# EAGLE design 99 (EAGLE 9.6.1)
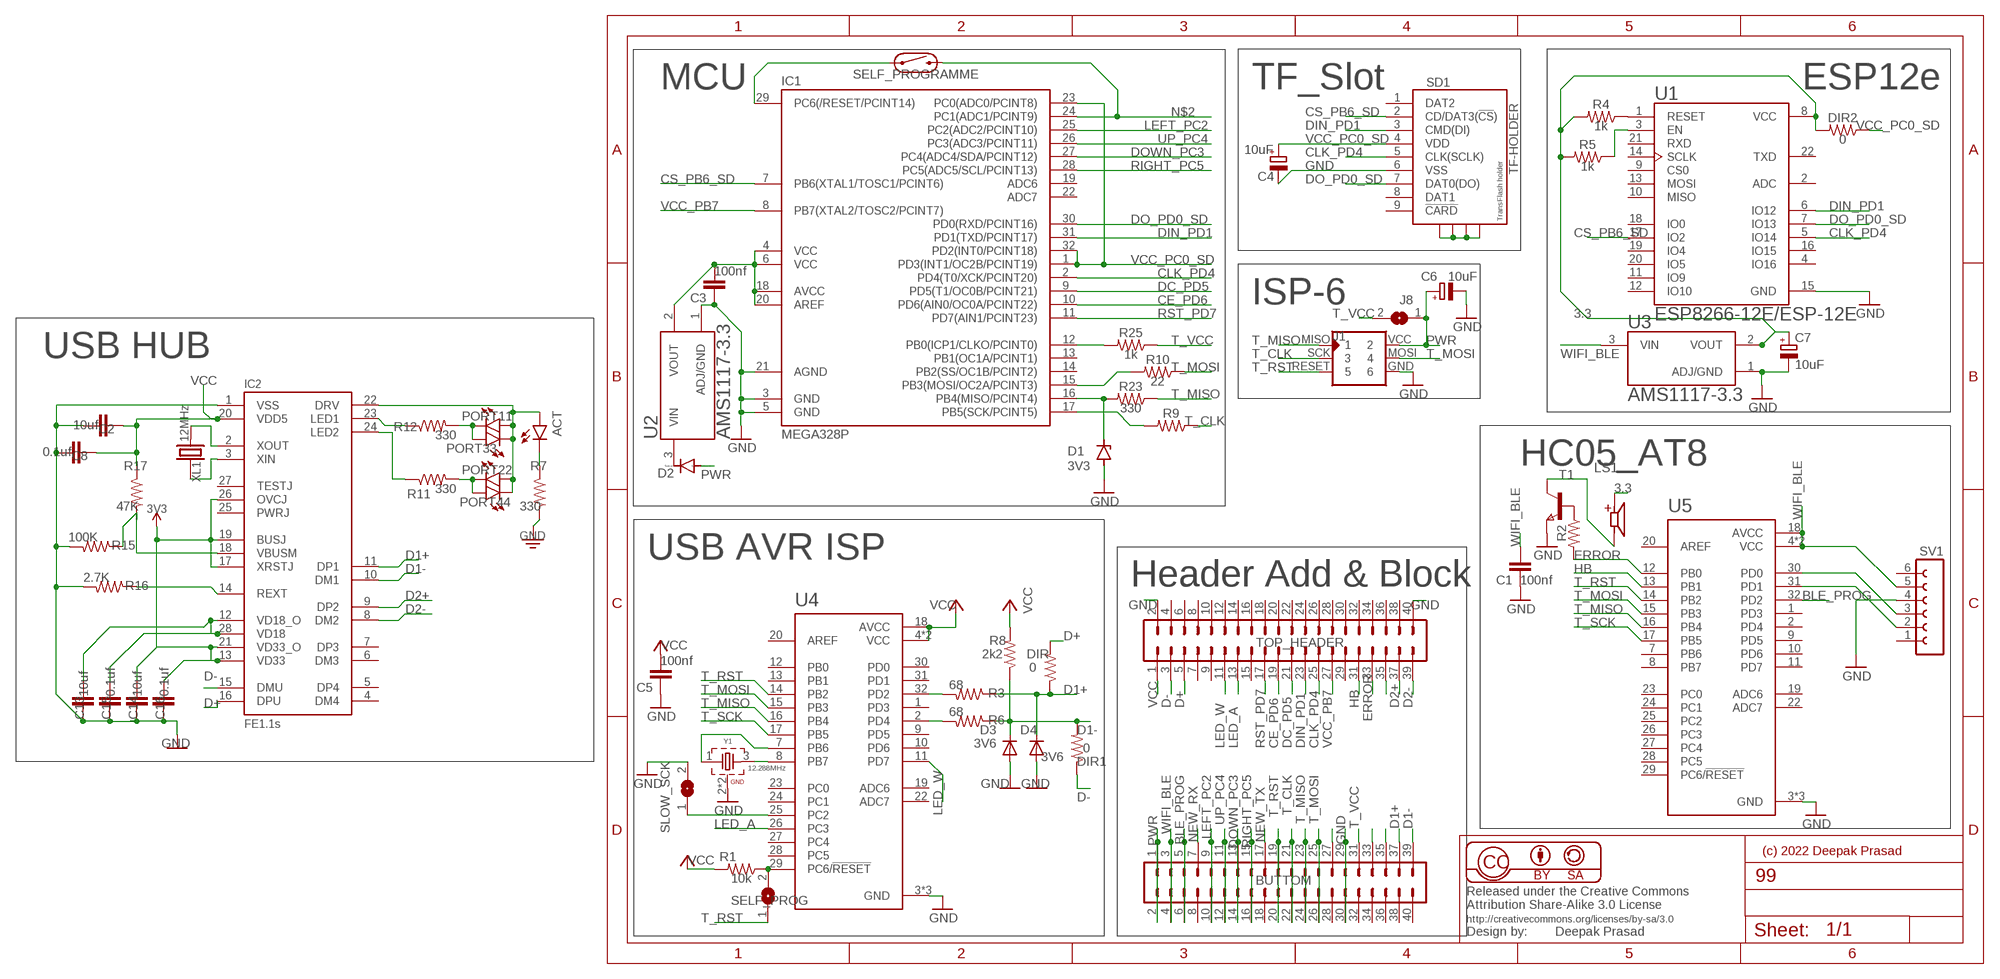
[diagram p0: schematic, sheet 1]

## Parts
ACT  LED1206  [LED-1206]
BUTTOM  MA20-2  [MA20-2]
C1  100nf  C-EUC1206  [C1206]
C2  10uf  C-EUC1206  [C1206]
C3  100nf  C-EUC1206  [C1206]
C4  10uF  CPOL-EUC/6032-28R  [C/6032-28R]
C5  100nf  C-EUC1206  [C1206]
C6  10uF  CPOL-EUC/6032-28R  [C/6032-28R]
C7  10uF  CPOL-EUC/6032-28R  [C/6032-28R]
C8  0.1uf  C-EUC1206  [C1206]
C13  10uf  C-EUC1206  [C1206]
C14  10uf  C-EUC1206  [C1206]
C15  0.1uf  C-EUC1206  [C1206]
C16  0.1uf  C-EUC1206  [C1206]
D1  3V3  ZENER-DIODESOD80C  [SOD80C]
D2  DIODE-DO214AC  [DO214AC]
D3  3V6  DIODESMA  [SMA-DIODE]
D4  3V6  DIODESMA  [SMA-DIODE]
DIR  0  R-US_CHIP-1206(3216-METRIC)  [RESC3216X70]
DIR1  0  R-US_CHIP-1206(3216-METRIC)  [RESC3216X70]
DIR2  0  R-US_CHIP-1206(3216-METRIC)  [RESC3216X70]
IC1  MEGA328P  MEGA48/88/168-AU  [TQFP32-08]
IC2  FE1.1S  [FE1.1S_SSOP-28]
J1  AVR-ISP-6PINAVR-ISP-6PIN  [AVR-ISP-6PIN]
J8  SJW  [SJW]
LS1  CMT-8530S-SMT  [CUI_CMT-8530S-SMT]
PORT11  LED1206  [LED-1206]
PORT22  LED1206  [LED-1206]
PORT33  LED1206  [LED-1206]
PORT44  LED1206  [LED-1206]
R1  10k  R-US_CHIP-1206(3216-METRIC)  [RESC3216X70]
R2  22  R-US_CHIP-1206(3216-METRIC)  [RESC3216X70]
R3  68  R-US_CHIP-1206(3216-METRIC)  [RESC3216X70]
R4  1k  R-US_CHIP-1206(3216-METRIC)  [RESC3216X70]
R5  1k  R-US_CHIP-1206(3216-METRIC)  [RESC3216X70]
R6  68  R-US_CHIP-1206(3216-METRIC)  [RESC3216X70]
R7  330  R-US_CHIP-1206(3216-METRIC)  [RESC3216X70]
R8  2k2  R-US_CHIP-1206(3216-METRIC)  [RESC3216X70]
R9  22  R-US_CHIP-1206(3216-METRIC)  [RESC3216X70]
R10  22  R-US_CHIP-1206(3216-METRIC)  [RESC3216X70]
R11  330  R-US_CHIP-1206(3216-METRIC)  [RESC3216X70]
R12  330  R-US_CHIP-1206(3216-METRIC)  [RESC3216X70]
R15  100K  R-US_CHIP-1206(3216-METRIC)  [RESC3216X70]
R16  2.7K  R-US_CHIP-1206(3216-METRIC)  [RESC3216X70]
R17  47K  R-US_CHIP-1206(3216-METRIC)  [RESC3216X70]
R23  330  R-US_CHIP-1206(3216-METRIC)  [RESC3216X70]
R25  1k  R-US_CHIP-1206(3216-METRIC)  [RESC3216X70]
SD1  TF-HOLDER  [TF-PULL]
SELF_PROG  SJW  [SJW]
SELF_PROGRAMME  REED_SWITCH-PTH-GLASS  [REED_SWITCH_GLASS]
SLOW_SCK  SJW  [SJW]
SV1  FE06-1  [FE06]
T1  NPNSOT23  [SOT-23]
TOP_HEADER  MA20-2  [MA20-2]
U1  ESP8266-12E/ESP-12E  [XCVR_ESP8266-12E/ESP-12E]
U2  AMS1117-3.3  [SOT229P700X180-4N]
U3  AMS1117-3.3  [SOT229P700X180-4N]
U4  ATMEGA328P-AU  [QFP80P900X900X120-32N]
U5  ATMEGA328P-AU  [QFP80P900X900X120-32N]
XL1  12MHz  CRYSTALHC49UP  [HC49UP]
Y1  12.288MHz  WE-XTAL_CFPX-104_830059523  [WE-XTAL_CFPX-104]

## Nets
3.3: C7.+ DIR2.2 LS1.P R4.2 R5.2 U1.8(VCC) U3.2(VOUT)
3V3: C14.2 C16.2 IC2.13(VD33) IC2.17(XRSTJ) IC2.19(BUSJ) IC2.21(VD33_O) IC2.26(OVCJ)
BLE_PROG: BUTTOM.5 BUTTOM.6 U5.32(PD2)
CE_PD6: IC1.10(PD6(AIN0/OC0A/PCINT22)) TOP_HEADER.19
CLK_PD4: IC1.2(PD4(T0/XCK/PCINT20)) SD1.5(CLK(SCLK)) TOP_HEADER.25 U1.5(IO14)
CS_PB6_SD: IC1.7(PB6(XTAL1/TOSC1/PCINT6)) SD1.2(CD/DAT3(!CS!)) U1.17(IO2)
D1+: BUTTOM.37 D4.C DIR.1 IC2.11(DP1) R3.1
D1-: BUTTOM.39 D3.C DIR1.2 IC2.10(DM1) R6.1 R8.1
D2+: IC2.9(DP2) TOP_HEADER.37
D2-: IC2.8(DM2) TOP_HEADER.39
D+: DIR.2 IC2.16(DPU) TOP_HEADER.5
D-: DIR1.1 IC2.15(DMU) TOP_HEADER.3
DC_PD5: IC1.9(PD5(T1/OC0B/PCINT21)) TOP_HEADER.21
DIN_PD1: IC1.31(PD1(TXD/PCINT17)) SD1.3(CMD(DI)) TOP_HEADER.23 U1.6(IO12)
DO_PD0_SD: IC1.30(PD0(RXD/PCINT16)) SD1.7(DAT0(DO)) U1.7(IO13)
DOWN_PC3: BUTTOM.13 BUTTOM.14 IC1.27(PC4(ADC4/SDA/PCINT12))
ERROR: R2.2 TOP_HEADER.33 U5.12(PB0)
GND [POWER]: BUTTOM.29 BUTTOM.30 C1.1 C2.2 C3.1 C4.- C5.1 C6.- C7.- C8.2 C13.1 C14.1 C15.1 C16.1 D1.A D3.A D4.A IC1.3(GND) IC1.5(GND) IC1.21(AGND) IC2.1(VSS) J1.GND R7.2 R15.2 R16.2 SD1.6(VSS) SLOW_SCK.2 SV1.4 T1.2(E) TOP_HEADER.2 TOP_HEADER.40 U1.15(GND) U2.1(ADJ/GND) U3.1(ADJ/GND) U4.3(GND) U4.5(GND) U4.21(GND) U5.3(GND) U5.5(GND) U5.21(GND) Y1.2(GND) Y1.4(GND)
GND1: SD1.S1 SD1.S2 SD1.S3 SD1.S4
HB: TOP_HEADER.31 U5.13(PB1)
LED_A: TOP_HEADER.13 U4.26(PC3)
LED_W: TOP_HEADER.11 U4.11(PD7)
LEFT_PC2: BUTTOM.9 BUTTOM.10 IC1.25(PC2(ADC2/PCINT10))
N$1: U4.8(PB7) Y1.3
N$2: IC1.24(PC1(ADC1/PCINT9)) SELF_PROGRAMME.P$2
N$3: R4.1 U1.1(RESET)
N$4: R2.1 T1.3(B)
N$5: R5.1 U1.3(EN)
N$6: IC1.12(PB0(ICP1/CLKO/PCINT0)) R25.2
N$7: D1.C IC1.16(PB4(MISO/PCINT4)) R23.2
N$8: U4.7(PB6) Y1.1
N$9: C3.2 IC1.4(VCC) IC1.6(VCC) IC1.18(AVCC) IC1.20(AREF) U2.2(VOUT)
N$10: R1.1 SELF_PROG.2 U4.29(PC6/!RESET)
N$11: D2.C U2.3(VIN)
N$12: IC1.29(PC6(/RESET/PCINT14)) SELF_PROGRAMME.P$1
N$13: SLOW_SCK.1 U4.25(PC2)
N$14: SV1.2 U5.31(PD1)
N$15: SV1.3 U5.30(PD0)
N$16: R3.2 U4.32(PD2)
N$17: IC2.14(REXT) R16.1
N$18: ACT.C R7.1
N$19: R6.2 U4.2(PD4)
N$20: C13.2 C15.2 IC2.12(VD18_O) IC2.28(VD18)
N$21: IC1.15(PB3(MOSI/OC2A/PCINT3)) R10.2
N$22: IC1.17(PB5(SCK/PCINT5)) R9.2
N$23: LS1.N T1.1(C)
N$24: IC2.23(LED1) R12.1
N$25: IC2.2(XOUT) XL1.2
N$26: IC2.3(XIN) XL1.1
N$27: PORT11.C PORT33.A R12.2
N$28: PORT22.C PORT44.A R11.2
N$32: TOP_HEADER.35
N$38: IC2.18(VBUSM) R15.1 R17.2
N$41: BUTTOM.27
N$44: BUTTOM.33
N$45: BUTTOM.35
N$48: IC2.24(LED2) R11.1
N$49: ACT.A IC2.22(DRV) PORT11.A PORT22.A PORT33.C PORT44.C
NEW_RX: BUTTOM.7
NEW_TX: BUTTOM.17
PWR: BUTTOM.1 BUTTOM.2 C6.+ D2.A J1.VCC J8.1
RIGHT_PC5: BUTTOM.15 BUTTOM.16 IC1.28(PC5(ADC5/SCL/PCINT13))
RST_PD7: IC1.11(PD7(AIN1/PCINT23)) TOP_HEADER.17
T_CLK: BUTTOM.21 BUTTOM.22 J1.SCK R9.1
T_MISO: BUTTOM.23 BUTTOM.24 J1.MISO R23.1 U4.16(PB4) U5.16(PB4)
T_MOSI: BUTTOM.25 BUTTOM.26 J1.MOSI R10.1 U4.15(PB3) U5.15(PB3)
T_RST: BUTTOM.19 BUTTOM.20 J1.RESET SELF_PROG.1 U4.14(PB2) U5.14(PB2)
T_SCK: U4.17(PB5) U5.17(PB5)
T_VCC: BUTTOM.31 J8.2 R25.1
UP_PC4: BUTTOM.11 BUTTOM.12 IC1.26(PC3(ADC3/PCINT11))
VCC [POWER]: C2.1 C5.2 C8.1 IC2.20(VDD5) R1.2 R8.2 R17.1 TOP_HEADER.1 U4.4(VCC) U4.6(VCC) U4.18(AVCC)
VCC_PB7: IC1.8(PB7(XTAL2/TOSC2/PCINT7)) TOP_HEADER.27
VCC_PC0_SD: C4.+ DIR2.1 IC1.1(PD3(INT1/OC2B/PCINT19)) IC1.23(PC0(ADC0/PCINT8)) IC1.32(PD2(INT0/PCINT18)) SD1.4(VDD)
WIFI_BLE: BUTTOM.3 BUTTOM.4 C1.2 SV1.5 U3.3(VIN) U5.4(VCC) U5.6(VCC) U5.18(AVCC)
Unconnected: BUTTOM.8 BUTTOM.18 BUTTOM.28 BUTTOM.32 BUTTOM.34 BUTTOM.36 BUTTOM.38 BUTTOM.40 IC1.13(PB1(OC1A/PCINT1)) IC1.14(PB2(SS/OC1B/PCINT2)) IC1.19(ADC6) IC1.22(ADC7) IC2.4(DM4) IC2.5(DP4) IC2.6(DM3) IC2.7(DP3) IC2.25(PWRJ) IC2.27(TESTJ) SD1.1(DAT2) SD1.8(DAT1) SD1.9(!CARD) SV1.1 SV1.6 TOP_HEADER.4 TOP_HEADER.6 TOP_HEADER.7 TOP_HEADER.8 TOP_HEADER.9 TOP_HEADER.10 TOP_HEADER.12 TOP_HEADER.14 TOP_HEADER.15 TOP_HEADER.16 TOP_HEADER.18 TOP_HEADER.20 TOP_HEADER.22 TOP_HEADER.24 TOP_HEADER.26 TOP_HEADER.28 TOP_HEADER.29 TOP_HEADER.30 TOP_HEADER.32 TOP_HEADER.34 TOP_HEADER.36 TOP_HEADER.38 U1.2(ADC) U1.4(IO16) U1.9(CS0) U1.10(MISO) U1.11(IO9) U1.12(IO10) U1.13(MOSI) U1.14(SCLK) U1.16(IO15) U1.18(IO0) U1.19(IO4) U1.20(IO5) U1.21(RXD) U1.22(TXD) U4.1(PD3) U4.9(PD5) U4.10(PD6) U4.12(PB0) U4.13(PB1) U4.19(ADC6) U4.20(AREF) U4.22(ADC7) U4.23(PC0) U4.24(PC1) U4.27(PC4) U4.28(PC5) U4.30(PD0) U4.31(PD1) U5.1(PD3) U5.2(PD4) U5.7(PB6) U5.8(PB7) U5.9(PD5) U5.10(PD6) U5.11(PD7) U5.19(ADC6) U5.20(AREF) U5.22(ADC7) U5.23(PC0) U5.24(PC1) U5.25(PC2) U5.26(PC3) U5.27(PC4) U5.28(PC5) U5.29(PC6/!RESET)

## Notes on the sheet
- MCU | TF_Slot | ESP12e
- ISP-6
- USB HUB
- HC05_AT8
- USB AVR ISP
- Header Add & Block
- (c) 2022 Deepak Prasad

## Library data of the parts
ACT PORT11 PORT22 PORT33 PORT44 = SparkFun-LED:LED: LED (Generic) Standard schematic elements and footprints for 5mm, 3mm, 1206, and 0603 sized LEDs. Generic LEDs with no color specified.
BUTTOM TOP_HEADER = con-lstb:MA20-2: PIN HEADER; OC_FARNELL: unknown; OC_NEWARK: unknown
C1-C3 C5 C8 C13-C16 = rcl:C-EU: CAPACITOR, European symbol; SPICEPREFIX: C
C4 C6 C7 = rcl:CPOL-EU: POLARIZED CAPACITOR, European symbol
D1 = diode:ZENER-DIODE: Z-Diode
D2 = diode:DIODE-: DIODE
D3 D4 = sparkfun:DIODE: Diode These are standard reverse protection diodes and small signal diodes. SMA package can handle up to about 1A. SOD-323 can handle about 200mA. What the SOD-323 package when ordering, there are some mfgs out there that are 5-pin packages.
DIR DIR1 DIR2 R1-R12 R15-R17 R23 R25 = Resistor:R-US: Resistor Fixed - ANSI; CATEGORY: Resistor; SUB-CATEGORY: Fixed
IC1 = avr-6:MEGA48/88/168
IC2 = Ai_IC:FE1.1S
J1 = avr-isp:AVR-ISP-6PIN: AVR ISP 6pin 3x2 pin header
J8 SELF_PROG SLOW_SCK = jumper:SJ: SMD solder JUMPER
LS1 = CMT-8530S-SMT:CMT-8530S-SMT: 8.5 mm, 3.6 Vo-p, 90 dB, Surface Mount (SMT), Magnetic Audio Transducer Buzzer Check availability <https://pricing.snapeda.com/parts/CMT-8530S-SMT-TR/CUI%20Devices/view-part?ref=eda>; AVAILABILITY: In Stock; CUI_PURCHASE_URL: https://www.cuidevices.com/product/audio/buzzers/audio-transducers/cmt-8530s-smt-tr?utm_source=snapeda.com&utm_medium=referral&utm_campaign=snapedaBOM; DESCRIPTION: 8.5 mm, 3.6 Vo-p, 90 dB, Surface Mount (SMT), Magnetic Audio Transducer Buzzer; MF: CUI Devices; MP: CMT-8530S-SMT-TR; PACKAGE: None; PRICE: None; PURCHASE-URL: https://pricing.snapeda.com/search/part/CMT-8530S-SMT-TR/?ref=eda
SD1 = sd-mmc:TF-HOLDER: TF / Micro SD socket is PUSH-PUSH type, the card can be pushed into and auto locked and pushed out by simply press the card. Surface Mounting type.
SELF_PROGRAMME = SparkFun-Switches:REED_SWITCH: Reed Switch A reed switch is a magnetically-actuated switch. When the device is exposed to a magnetic field, the two ferrous materials inside the switch pull together and the switch closes. Variant Overview PTH-GLASS Reed Switch <https://www.sparkfun.com/products/8642> (COM-08642) - PTH reed switch w/ glass body (6.0 x 0.9 mm) PTH-INSULATED Reed Switch - Insulated <https://www.sparkfun.com/products/10601> (COM-10601) - PTH reed switch w/ insulated body (15.1 x 4.2 mm); PROD_ID: SWCH-09282; SF_SKU: COM-08642
SV1 = con-lsta:FE06-1: FEMALE HEADER; OC_FARNELL: unknown; OC_NEWARK: unknown
T1 = zetex:NPNSOT23: NPN TRANSISTOR; MPN: DSS20201L-7; OC_FARNELL: 1710688; OC_NEWARK: 25R4555
U1 = ESP8266-12E_ESP-12E:ESP8266-12E/ESP-12E: ESP-12E WiFi Module Check availability <https://pricing.snapeda.com/parts/ESP8266-12E/ESP-12E/AI-Thinker/view-part?ref=eda>; AVAILABILITY: Not in stock; DESCRIPTION: This WiFi module has a 32-bit MCU micro and clock speeds supporting 80 MHz or 160 MHz. Supports the RTOS and integrated Wi-Fi MAC/BB/RF/PA/LNA, and has an on-board antenna.; MF: AI-Thinker; MP: ESP8266-12E/ESP-12E; PACKAGE: None; PRICE: None
U2 U3 = AMS1117-3.3:AMS1117-3.3: Sot223/Pkg 1-Amp 3.3-Volt Low Drop Out Voltage Regulatator Check availability <https://pricing.snapeda.com/parts/AMS1117-3.3/Advanced%20Monolithic%20Systems/view-part?ref=eda>; AVAILABILITY: In Stock; DESCRIPTION: Sot223/Pkg 1-Amp 3.3-Volt Low Drop Out Voltage Regulatator; MF: Advanced Monolithic Systems; MP: AMS1117-3.3; PACKAGE: SOT-223 Seeed Technology; PRICE: None
U4 U5 = ATMEGA328P-AU:ATMEGA328P-AU: ATmega Series 20 MHz 32 KB Flash 2 KB SRAM 8-Bit Microcontroller - TQFP-32 Check availability <https://pricing.snapeda.com/parts/ATMEGA328P-AU/Microchip%20Technology/view-part?ref=eda>; AVAILABILITY: In Stock; DESCRIPTION: AVR AVR® ATmega Microcontroller IC 8-Bit 20MHz 32KB (16K x 16) FLASH 32-TQFP (7x7); MF: Microchip Technology; MP: ATMEGA328P-AU; PACKAGE: TQFP-32 Microchip; PRICE: None; PURCHASE-URL: https://pricing.snapeda.com/search/part/ATMEGA328P-AU/?ref=eda
XL1 = Ai_FrequencyControl:CRYSTAL: PTH: ... SMD: ... Cylinder: CMR200T-32.768KDZBT
Y1 = Wurth_Quartz Crystals & Oscillators_WE-XTAL:WE-XTAL_CFPX-104: WE-XTAL Quartz Crystal Characteristics SMT and THT models Hermetically sealed Frequencies between 1.8432 MHz and 50 MHz Tolerances down to ±10 ppm available Maximum operating temperatures range: -40 °C to 85 °C Stabilities down to ±10 ppm available Applications Microprocessor Wireless Communication Devices Industrial Devices Wired Communication (e.g. Ethernet and USB) IoT Optical Network Audio and Multimedia Devices Test and Measurement Equipment Navigation and Locators Wearables <https://www.we-online.com/catalog/media/o135919v209%20Family_WE-XTAL_IQXC-42.jpg> Details see: https://www.we-online.com/catalog/en/WE-XTAL Updated by Ella Wu , 2020-11-23 2020 (C) Wurth Elektronik; C-LOAD: 18pF; DATASHEET-URL: https://www.we-online.com/catalog/datasheet/830059523.pdf; MOUNT: SMT; PART-NUMBER: 830059523; STABILITY: 30ppm; TOLERANCE: ±20ppm

## Net classes
0 default: width 0.254 mm, clearance 0.254 mm
1 POWER: width 0.254 mm, clearance 0.254 mm

## Board
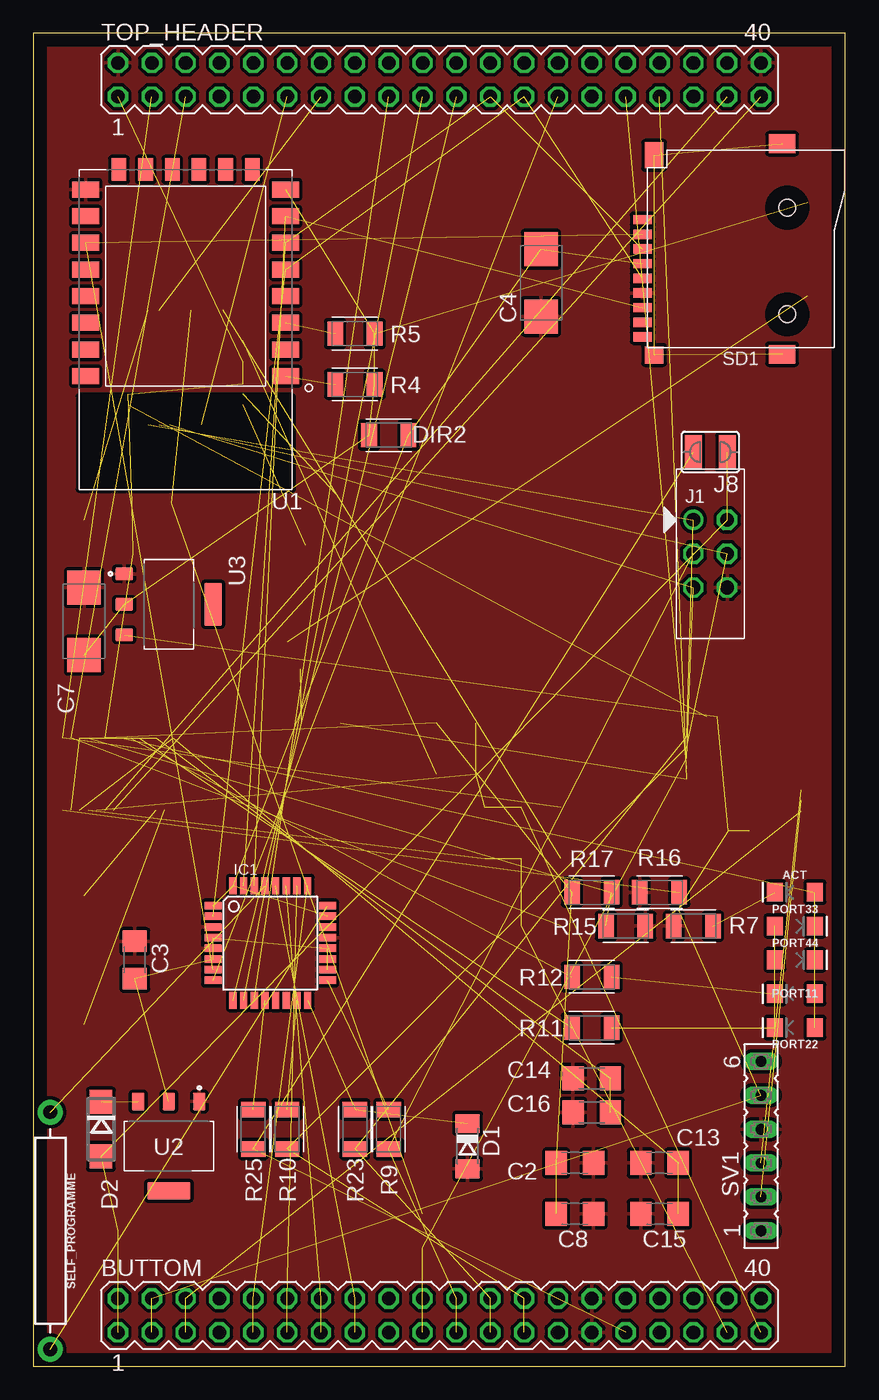
[diagram p1: board, top side]
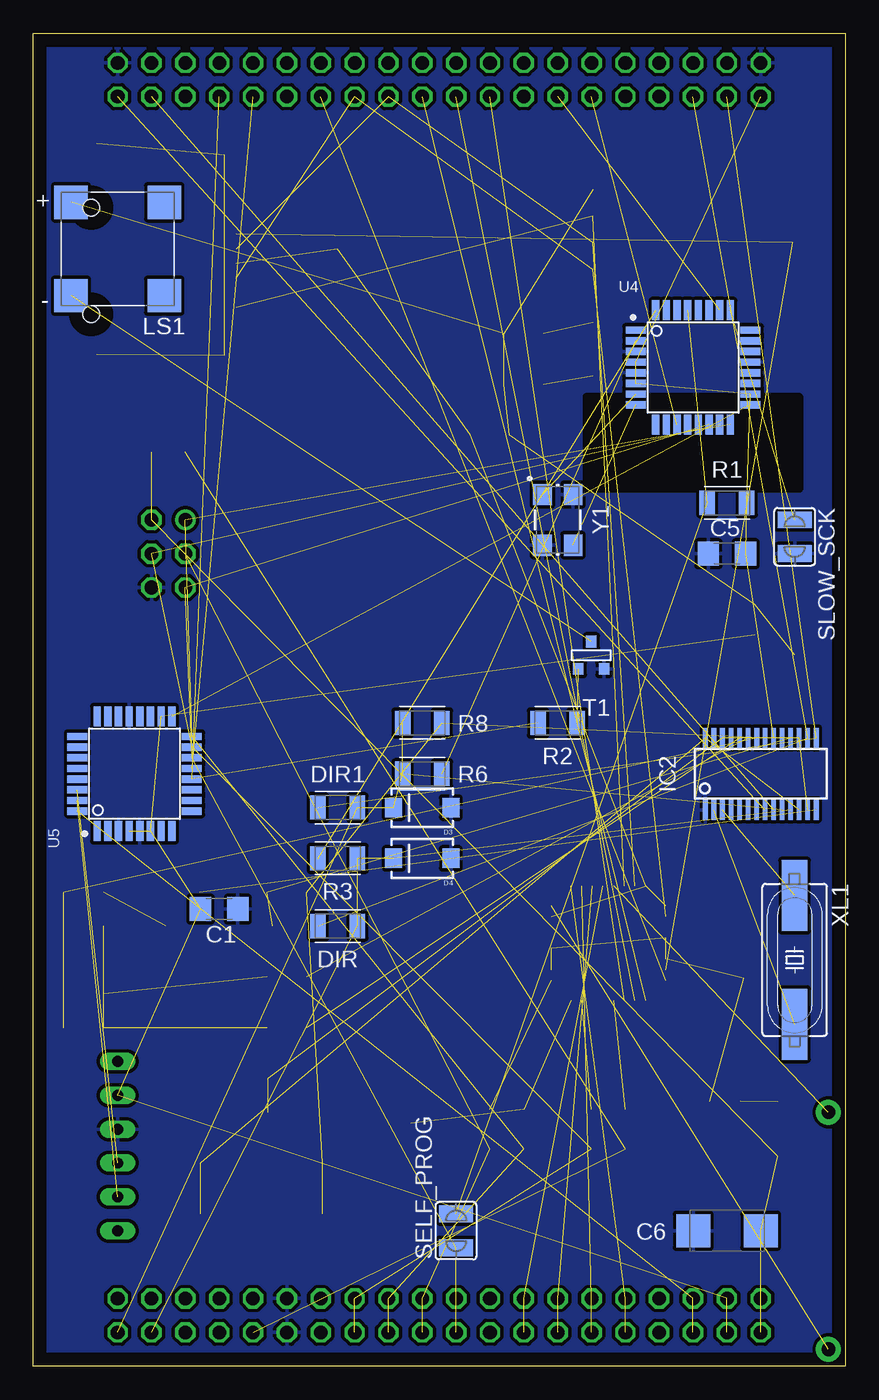
[diagram p2: board, bottom side, seen from below]

Size 60.94 x 100 mm. Coordinates in mm from the lower left corner, seen from the top.
Outline: 0,0 60.94,0 60.94,100 0,100 0,0
Copper layers (1*16): Top 0.035mm / dielectric 1.5mm / Bottom 0.035mm
Design rules "default": minimum track width 6mil, minimum drill 0.35mm, track to track 6mil, track to pad 6mil, pad to pad 6mil, via to via 6mil, smd to smd 6mil, copper to edge 40mil, drill to drill 6mil, minimum pad ring 10mil, minimum via ring 8mil, stop-mask expansion 4mil, vias tented up to drill 0mil, thermal gap 10mil

### Footprints (pad centres in the part's own frame; a part is rotated, then mirrored left to right if it is on the bottom)
LED-1206 = smd 1.2 x 1.4: A -1.5,0; C 1.5,0
MA20-2 = drill 1.016 octagon: 1 -24.13,-1.27; 2 -24.13,1.27; 3 -21.59,-1.27; 4 -21.59,1.27; 5 -19.05,-1.27; 6 -19.05,1.27; 7 -16.51,-1.27; 8 -16.51,1.27; 9 -13.97,-1.27; 10 -13.97,1.27; 11 -11.43,-1.27; 12 -11.43,1.27; 13 -8.89,-1.27; 14 -8.89,1.27; 15 -6.35,-1.27; 16 -6.35,1.27; 17 -3.81,-1.27; 18 -3.81,1.27; 19 -1.27,-1.27; 20 -1.27,1.27; 21 1.27,-1.27; 22 1.27,1.27; 23 3.81,-1.27; 24 3.81,1.27; 25 6.35,-1.27; 26 6.35,1.27; 27 8.89,-1.27; 28 8.89,1.27; 29 11.43,-1.27; 30 11.43,1.27; 31 13.97,-1.27; 32 13.97,1.27; 33 16.51,-1.27; 34 16.51,1.27; 35 19.05,-1.27; 36 19.05,1.27; 37 21.59,-1.27; 38 21.59,1.27; 39 24.13,-1.27; 40 24.13,1.27
C1206 = smd 1.6 x 1.8: 1 -1.4,0; 2 1.4,0
C/6032-28R = smd 2.55 x 2.5: + 2.525,0; - -2.525,0
SOD80C = smd 1.4 x 1.8: A 1.7,0; C -1.7,0
DO214AC = smd 1.8 x 1.7: A 2.05,0; C -2.05,0
SMA-DIODE = smd 1.27 x 1.47: A -2.15,0; C 2.15,0
RESC3216X70 = smd 1.165 x 1.815: 1 -1.475,0; 2 1.475,0
TQFP32-08 = smd 1.27 x 0.559: 1 -4.293,2.8; 2 -4.293,2; 3 -4.293,1.2; 4 -4.293,0.4; 5 -4.293,-0.4; 6 -4.293,-1.2; 7 -4.293,-2; 8 -4.293,-2.8; 17 4.293,-2.8; 18 4.293,-2; 19 4.293,-1.2; 20 4.293,-0.4; 21 4.293,0.4; 22 4.293,1.2; 23 4.293,2; 24 4.293,2.8 | smd 0.559 x 1.27: 9 -2.8,-4.293; 10 -2,-4.293; 11 -1.2,-4.293; 12 -0.4,-4.293; 13 0.4,-4.293; 14 1.2,-4.293; 15 2,-4.293; 16 2.8,-4.293; 25 2.8,4.293; 26 2,4.293; 27 1.2,4.293; 28 0.4,4.293; 29 -0.4,4.293; 30 -1.2,4.293; 31 -2,4.293; 32 -2.8,4.293
FE1.1S_SSOP-28 = smd 0.35 x 1.5: 1 -4.16,-2.7; 2 -3.52,-2.7; 3 -2.88,-2.7; 4 -2.24,-2.7; 5 -1.6,-2.7; 6 -0.96,-2.7; 7 -0.32,-2.7; 8 0.32,-2.7; 9 0.96,-2.7; 10 1.6,-2.7; 11 2.24,-2.7; 12 2.88,-2.7; 13 3.52,-2.7; 14 4.16,-2.7; 15 4.16,2.7; 16 3.52,2.7; 17 2.88,2.7; 18 2.24,2.7; 19 1.6,2.7; 20 0.96,2.7; 21 0.32,2.7; 22 -0.3,2.7; 23 -0.96,2.7; 24 -1.6,2.7; 25 -2.24,2.7; 26 -2.88,2.7; 27 -3.52,2.7; 28 -4.16,2.7
AVR-ISP-6PIN = drill 1.016 octagon: GND 1.27,-2.54; MOSI 1.27,0; RESET -1.27,-2.54; SCK -1.27,0; VCC 1.27,2.54 | drill 1.016: MISO -1.27,2.54
SJW = smd 1.27 x 2.54: 1 -1.27,0; 2 1.27,0
CUI_CMT-8530S-SMT = smd 2.5 x 2.5: 1 -3.5,3.5; 2 -3.5,-3.5; N 3.5,3.5; P 3.5,-3.5
TF-PULL = smd 0.7 x 1.4: 1 -2.2,-7.62; 2 -1.1,-7.62; 3 0,-7.62; 4 1.1,-7.62; 5 2.2,-7.62; 6 3.3,-7.62; 7 4.4,-7.62; 8 5.5,-7.62; 9 6.6,-7.62 | smd 1.4 x 2: S1 -7.9,2.85; S2 7.9,2.85 | smd 1.28 x 1.4: S3 7.96,-6.75 | smd 1.95 x 1.4: S4 -7.025,-6.75 | hole 1.25: -3.1,3.25; 4.9,3.25
REED_SWITCH_GLASS = drill 1.016 pad 1.88: P$1 -8.89,0; P$2 8.89,0
FE06 = drill 0.813 long: 1 -6.35,0; 2 -3.81,0; 3 -1.27,0; 4 1.27,0; 5 3.81,0; 6 6.35,0
SOT-23 = smd 0.787 x 0.889: 1 0.025,-1.016; 2 -0.94,1.016; 3 0.991,1.016
XCVR_ESP8266-12E/ESP-12E = smd 2 x 1.2: 1 -7.5,7; 2 -7.5,5; 3 -7.5,3; 4 -7.5,1; 5 -7.5,-1; 6 -7.5,-3; 7 -7.5,-5; 8 -7.5,-7; 15 7.5,-7; 16 7.5,-5; 17 7.5,-3; 18 7.5,-1; 19 7.5,1; 20 7.5,3; 21 7.5,5; 22 7.5,7 | smd 1.1 x 1.7: 9 -5,-8.5; 10 -3,-8.5; 11 -1,-8.5; 12 1,-8.5; 13 3,-8.5; 14 5,-8.5
SOT229P700X180-4N = smd 0.93 x 1.31: 1 -2.29,-3.345; 2 0,-3.345; 3 2.29,-3.345 | smd 3.24 x 1.31: 4 0,3.345
QFP80P900X900X120-32N = smd 1.5 x 0.55: 1 -4.3,2.8; 2 -4.3,2; 3 -4.3,1.2; 4 -4.3,0.4; 5 -4.3,-0.4; 6 -4.3,-1.2; 7 -4.3,-2; 8 -4.3,-2.8; 17 4.3,-2.8; 18 4.3,-2; 19 4.3,-1.2; 20 4.3,-0.4; 21 4.3,0.4; 22 4.3,1.2; 23 4.3,2; 24 4.3,2.8 | smd 0.55 x 1.5: 9 -2.8,-4.3; 10 -2,-4.3; 11 -1.2,-4.3; 12 -0.4,-4.3; 13 0.4,-4.3; 14 1.2,-4.3; 15 2,-4.3; 16 2.8,-4.3; 25 2.8,4.3; 26 2,4.3; 27 1.2,4.3; 28 0.4,4.3; 29 -0.4,4.3; 30 -1.2,4.3; 31 -2,4.3; 32 -2.8,4.3
HC49UP = smd 5.334 x 1.93: 1 -4.826,0; 2 4.826,0
WE-XTAL_CFPX-104 = smd 1.6 x 1.4: 1 -1.9,-1.15; 2 1.9,-1.15; 3 1.9,1.15; 4 -1.9,1.15

### Placement (x,y rotation side)
ACT  57.15,35.56 180 top
BUTTOM  30.48,3.81 0 top
C1  46.99,34.29 180 bottom
C2  40.64,15.24 0 top
C3  7.62,30.48 270 top
C4  38.1,81.28 90 top
C5  8.89,60.96 0 bottom
C6  8.89,10.16 0 bottom
C7  3.81,55.88 270 top
C8  40.64,11.43 0 top
C13  46.99,15.24 0 top
C14  41.91,21.59 0 top
C15  46.99,11.43 0 top
C16  41.91,19.05 0 top
D1  32.59,16.51 270 top
D2  5.08,17.78 270 top
D3  31.75,41.91 180 bottom
D4  31.75,38.1 180 bottom
DIR  38.1,33.02 180 bottom
DIR1  38.1,41.91 0 bottom
DIR2  26.67,69.85 180 top
IC1  17.78,31.75 0 top
IC2  6.35,44.45 0 bottom
J1  50.8,60.96 0 top
J8  50.8,68.58 180 top
LS1  54.61,83.82 180 bottom
PORT11  57.15,27.94 180 top
PORT22  57.15,25.4 180 top
PORT33  57.15,33.02 0 top
PORT44  57.15,30.48 0 top
R1  8.89,64.77 0 bottom
R2  21.59,48.26 180 bottom
R3  38.1,38.1 180 bottom
R4  24.13,73.66 0 top
R5  24.13,77.47 0 top
R6  31.75,44.45 0 bottom
R7  49.53,33.02 180 top
R8  31.75,48.26 0 bottom
R9  26.67,17.78 90 top
R10  19.05,17.78 90 top
R11  41.91,25.4 0 top
R12  41.91,29.21 0 top
R15  44.45,33.02 0 top
R16  46.99,35.56 180 top
R17  41.91,35.56 0 top
R23  24.13,17.78 90 top
R25  16.51,17.78 90 top
SD1  53.34,83.82 270 top
SELF_PROG  29.21,10.16 90 bottom
SELF_PROGRAMME  1.27,10.16 270 top
SLOW_SCK  3.81,62.23 270 bottom
SV1  54.61,16.51 90 top
T1  19.05,53.34 180 bottom
TOP_HEADER  30.48,96.52 0 top
U1  11.43,81.28 180 top
U2  10.16,16.51 180 top
U3  10.16,57.15 270 top
U4  11.43,74.93 0 bottom
U5  53.34,44.45 90 bottom
XL1  3.81,30.48 270 bottom
Y1  21.59,63.5 270 bottom

### Tracks (layer width: path | path; a pad name or v marks a point on that pad's centre or on a via)
3.3  (6 unrouted)
3V3  (6 unrouted)
BLE_PROG  (2 unrouted)
CE_PD6  (1 unrouted)
CLK_PD4  (3 unrouted)
CS_PB6_SD  (2 unrouted)
D1+  (4 unrouted)
D1-  (5 unrouted)
D2+  (1 unrouted)
D2-  (1 unrouted)
D+  (2 unrouted)
D-  (2 unrouted)
DC_PD5  (1 unrouted)
DIN_PD1  (3 unrouted)
DO_PD0_SD  (2 unrouted)
DOWN_PC3  (2 unrouted)
ERROR  (2 unrouted)
GND
  pour Top (isolate 0.254): 0,100.33 0,0 60.96,0 60.96,99.06 62.23,100.33 1.27,100.33
  pour Bottom (isolate 0.254): 0,100.33 0,0 60.96,0 60.96,100.33
GND1  (3 unrouted)
HB  (1 unrouted)
LED_A  (1 unrouted)
LED_W  (1 unrouted)
LEFT_PC2  (2 unrouted)
N$1  (1 unrouted)
N$2  (1 unrouted)
N$3  (1 unrouted)
N$4  (1 unrouted)
N$5  (1 unrouted)
N$6  (1 unrouted)
N$7  (2 unrouted)
N$8  (1 unrouted)
N$9  (5 unrouted)
N$10  (2 unrouted)
N$11  (1 unrouted)
N$12  (1 unrouted)
N$13  (1 unrouted)
N$14  (1 unrouted)
N$15  (1 unrouted)
N$16  (1 unrouted)
N$17  (1 unrouted)
N$18  (1 unrouted)
N$19  (1 unrouted)
N$20  (3 unrouted)
N$21  (1 unrouted)
N$22  (1 unrouted)
N$23  (1 unrouted)
N$24  (1 unrouted)
N$25  (1 unrouted)
N$26  (1 unrouted)
N$27  (2 unrouted)
N$28  (2 unrouted)
N$38  (2 unrouted)
N$48  (1 unrouted)
N$49  (5 unrouted)
PWR  (5 unrouted)
RIGHT_PC5  (2 unrouted)
RST_PD7  (1 unrouted)
T_CLK  (3 unrouted)
T_MISO  (5 unrouted)
T_MOSI  (5 unrouted)
T_RST  (5 unrouted)
T_SCK  (1 unrouted)
T_VCC  (2 unrouted)
UP_PC4  (2 unrouted)
VCC  (10 unrouted)
VCC_PB7  (1 unrouted)
VCC_PC0_SD  (5 unrouted)
WIFI_BLE  (7 unrouted)